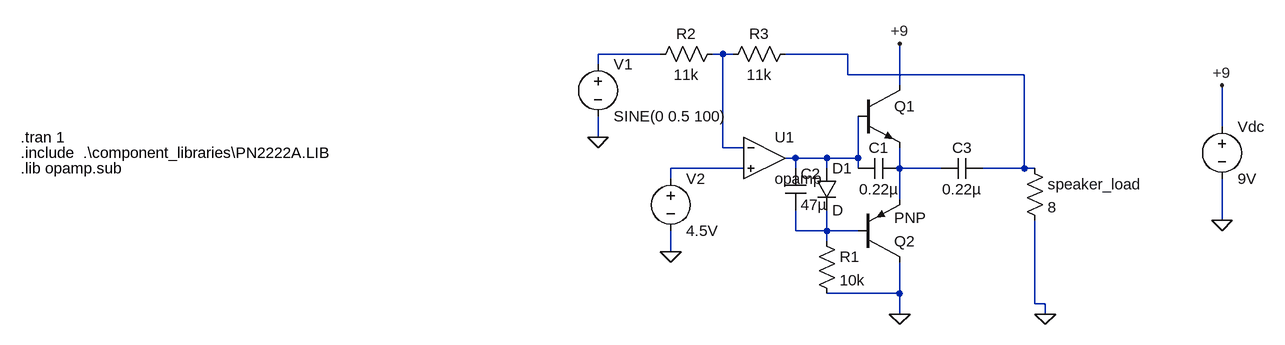
[diagram p0: schematic analogue_amp.asc]
analogue_amp.asc, the LTspice schematic file:
Version 4
SHEET 1 956 680
WIRE -64 -64 -160 -64
WIRE 32 -64 16 -64
WIRE 48 -64 32 -64
WIRE 224 -64 128 -64
WIRE -160 -48 -160 -64
WIRE 224 -32 224 -64
WIRE 496 -32 224 -32
WIRE 304 -16 304 -80
WIRE 800 48 800 -16
WIRE -160 64 -160 32
WIRE 32 80 32 -64
WIRE 64 80 32 80
WIRE 144 96 128 96
WIRE 192 96 144 96
WIRE 240 96 240 32
WIRE 240 96 192 96
WIRE 64 112 -48 112
WIRE 144 112 144 96
WIRE 192 112 192 96
WIRE 240 112 240 96
WIRE 304 112 304 80
WIRE 368 112 304 112
WIRE 496 112 496 -32
WIRE 496 112 432 112
WIRE 512 112 496 112
WIRE -48 128 -48 112
WIRE 304 160 304 112
WIRE 800 192 800 128
WIRE 144 208 144 176
WIRE 192 208 192 176
WIRE 192 208 144 208
WIRE 240 208 192 208
WIRE 192 224 192 208
WIRE -48 240 -48 208
WIRE 304 304 304 256
WIRE 304 304 192 304
WIRE 512 320 512 192
WIRE 528 320 512 320
WIRE 304 336 304 304
WIRE 528 336 528 320
FLAG 304 336 0
FLAG 800 192 0
FLAG 800 -16 +9
FLAG 304 -80 +9
FLAG 528 336 0
FLAG -160 64 0
FLAG -48 240 0
SYMBOL Opamps\\opamp 96 32 R0
SYMATTR InstName U1
SYMBOL npn2 240 -16 R0
WINDOW 3 56 68 Invisible 2
SYMATTR InstName Q1
SYMATTR Value ""
SYMATTR SpiceModel PN2222A
SYMBOL pnp2 240 256 M180
SYMATTR InstName Q2
SYMBOL voltage 800 32 R0
SYMATTR InstName Vdc
SYMATTR Value 9V
SYMBOL res 496 96 R0
SYMATTR InstName speaker_load
SYMATTR Value 8
SYMBOL cap 304 96 R90
WINDOW 0 0 32 VBottom 2
WINDOW 3 32 32 VTop 2
SYMATTR InstName C1
SYMATTR Value 0.22µ
SYMBOL diode 176 112 R0
SYMATTR InstName D1
SYMBOL cap 128 112 R0
SYMATTR InstName C2
SYMATTR Value 47µ
SYMBOL res 176 208 R0
SYMATTR InstName R1
SYMATTR Value 10k
SYMBOL res 32 -80 R90
WINDOW 0 0 56 VBottom 2
WINDOW 3 32 56 VTop 2
SYMATTR InstName R2
SYMATTR Value 11k
SYMBOL res 144 -80 R90
WINDOW 0 0 56 VBottom 2
WINDOW 3 32 56 VTop 2
SYMATTR InstName R3
SYMATTR Value 11k
SYMBOL voltage -160 -64 R0
WINDOW 123 0 0 Left 0
WINDOW 39 0 0 Left 0
SYMATTR InstName V1
SYMATTR Value SINE(0 0.5 100)
SYMBOL voltage -48 112 R0
SYMATTR InstName V2
SYMATTR Value 4.5V
SYMBOL cap 432 96 R90
WINDOW 0 0 32 VBottom 2
WINDOW 3 32 32 VTop 2
SYMATTR InstName C3
SYMATTR Value 0.22µ
TEXT -1048 64 Left 2 !.tran 1
TEXT -1048 112 Left 2 !.lib opamp.sub
TEXT -1048 88 Left 2 !.include  .\\component_libraries\\PN2222A.LIB

The netlist it stands for:
* analogue_amp.asc
XU1 N002 N005 N004 opamp Aol=100K GBW=10Meg  ; pins invin noninvin out
Q1 +9 N004 N006 0 PN2222A
Q2 0 N007 N006 0 PNP
Vdc +9 0 9V
R§speaker_load N003 0 8
C1 N006 N004 0.22µ
D1 N004 N007 D
C2 N004 N007 47µ
R1 N007 0 10k
R2 N002 N001 11k
R3 N003 N002 11k
V1 N001 0 SINE(0 0.5 100)
V2 N005 0 4.5V
C3 N003 N006 0.22µ
.model D D
.lib standard.dio
.model NPN NPN
.model PNP PNP
.lib standard.bjt
.tran 1
.lib opamp.sub
.include  .\component_libraries\PN2222A.LIB
.backanno
.end